# Altium schematic sheet subckt_-3V6_charge_pump.SchDoc: Charge pump 3V6
size A3; DocumentNumber: 7; Revision: 0; SheetNumber: 7; SheetTotal: 19
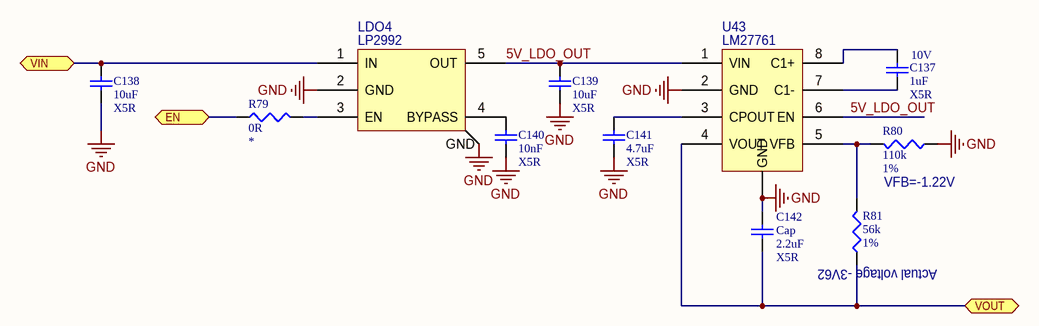
[diagram p0: subckt_-3V6_charge_pump.SchDoc]

## Parts
C137  10V  value 1uF  Dielectric: X5R  [TBD]
C138  value 10uF  Dielectric: X5R  [TBD]  (hidden comment: Capacitor)
C139  value 10uF  Dielectric: X5R  [TBD]  (hidden comment: Capacitor)
C140  value 10nF  Dielectric: X5R  [TBD]  (hidden comment: Capacitor)
C141  value 4.7uF  Dielectric: X5R  [TBD]  (hidden comment: Capacitor)
C142  Cap  value 2.2uF  Dielectric: X5R  [TBD]
LDO4  LP2992
R79  value 0R  [RES0603]  (hidden comment: Resistor)
R80  value 110k  Type: 1%  [RES0603]  (hidden comment: Resistor)
R81  value 56k  Type: 1%  [RES0603]  (hidden comment: Resistor)
U43  LM27761

## Ports
EN, VIN, VOUT

## Nets
GND: C138.1 C139.1 C140.1 C141.1 C142.1 LDO4.2(GND) LDO4.6(GND) R80.1 U43.2(GND) U43.9(GND)
5V_LDO_OUT: C139.2 LDO4.5(OUT) U43.1(VIN) U43.6(EN)
EN: R79.1 ; port EN
VIN: C138.2 LDO4.1(IN) ; port VIN
VOUT: C142.2 R81.1 U43.4(VOUT) ; port VOUT
NetC137_1: C137.1 U43.7(C1-)
NetC137_2: C137.2 U43.8(C1+)
NetC140_2: C140.2 LDO4.4(BYPASS)
NetC141_2: C141.2 U43.3(CPOUT)
NetLDO4_3: LDO4.3(EN) R79.2
NetR80_2: R80.2 R81.2 U43.5(VFB)

## Notes on the sheet
- VFB=-1.22V
- Actual voltage -3V62

## Library data of the parts
C137 C142 = Capacitor
LDO4 = LP2992: LDO 5V 250mA
U43 = LM27761: Inverting charge pump w/ LDO, -1.5V to -5V
R79-R81 = Resistor
  R79: Type: *